# EAGLE design db9splitter (EAGLE 9.0.0)
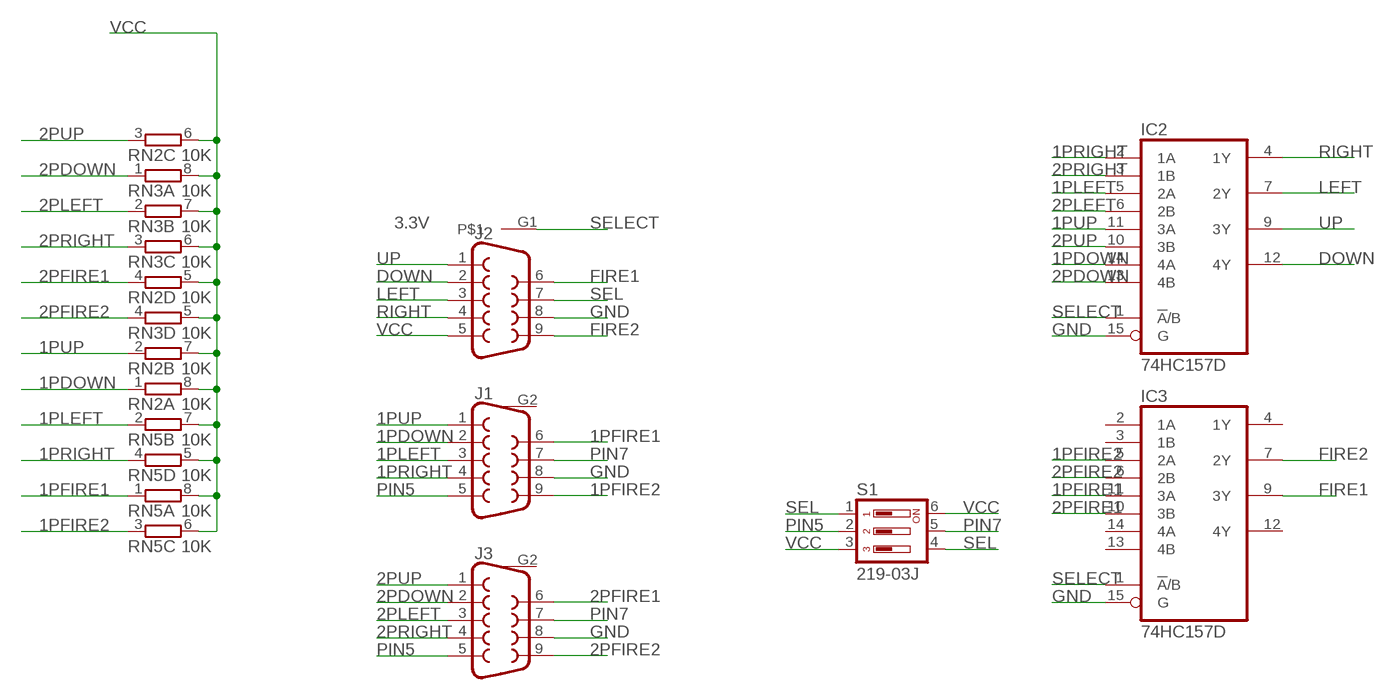
[diagram p0: schematic, sheet 1]

## Parts
IC2  74HC157D  [SO16]
IC3  74HC157D  [SO16]
J1  SPARKFUN-CONNECTORS_DB9MALE  [SPARKFUN-CONNECTORS_DB9_MALE]
J2  DB9FEMALE  [DB9]
J3  SPARKFUN-CONNECTORS_DB9MALE  [SPARKFUN-CONNECTORS_DB9_MALE]
RN2  10K  4R-N0603-ARC  [0603-ARC]
RN3  10K  4R-N0603-ARC  [0603-ARC]
RN5  10K  4R-N0603-ARC  [0603-ARC]
S1  219-03J  [CTS-219-03J]

## Nets
1PDOWN: IC2.14(4A) J1.2 RN2.1
1PFIRE1: IC3.11(3A) J1.6 RN5.1
1PFIRE2: IC3.5(2A) J1.9 RN5.3
1PLEFT: IC2.5(2A) J1.3 RN5.2
1PRIGHT: IC2.2(1A) J1.4 RN5.4
1PUP: IC2.11(3A) J1.1 RN2.2
2PDOWN: IC2.13(4B) J3.2 RN3.1
2PFIRE1: IC3.10(3B) J3.6 RN2.4
2PFIRE2: IC3.6(2B) J3.9 RN3.4
2PLEFT: IC2.6(2B) J3.3 RN3.2
2PRIGHT: IC2.3(1B) J3.4 RN3.3
2PUP: IC2.10(3B) J3.1 RN2.3
DOWN: IC2.12(4Y) J2.2
FIRE1: IC3.9(3Y) J2.6
FIRE2: IC3.7(2Y) J2.9
GND: IC2.15(G) IC3.15(G) J1.8 J2.8 J3.8
LEFT: IC2.7(2Y) J2.3
PIN5: J1.5 J3.5 S1.2
PIN7: J1.7 J3.7 S1.5
RIGHT: IC2.4(1Y) J2.4
SEL: J2.7 S1.1 S1.4
SELECT: IC2.1(!A!/B) IC3.1(!A!/B) J2.G1
UP: IC2.9(3Y) J2.1
VCC: J2.5 RN2.5 RN2.6 RN2.7 RN2.8 RN3.5 RN3.6 RN3.7 RN3.8 RN5.5 RN5.6 RN5.7 RN5.8 S1.3 S1.6
Unconnected: IC3.2(1A) IC3.3(1B) IC3.4(1Y) IC3.12(4Y) IC3.13(4B) IC3.14(4A) J1.G2 J3.G2

## Power pins joined to a net without a drawn wire
GND: IC2.8(GND) IC3.8(GND)
VCC: IC2.16(VCC) IC3.16(VCC)

## Library data of the parts
IC2 IC3 = 74xx-eu:74*157: Quadruple 2-line to 1-line data SELECTOR/MULTIPLEXER
J1 J3 = mister_io2:SPARKFUN-CONNECTORS_DB9: DB9 Connector Standard DB9 (D-Sub 9) serial connector. Can be used for CAN bus as well as RS485 and RS232. Footprint production proven. Here is the female version connector we sell at SparkFun: 9 Pin Female Serial Connector - PCB Mount <https://www.sparkfun.com/products/429> (PRT-00429) This connector has been used on the following SparkFun products: SparkFun RS232 Shifter - SMD <https://www.sparkfun.com/products/449> (PRT-00449) SparkFun RS232 Shifter SMD (No DB9) <https://www.sparkfun.com/products/8780> (PRT-08780); PROD_ID: CONN-09904
J2 = SparkFun-Connectors:DB9: DB9 Connector Standard DB9 (D-Sub 9) serial connector. Can be used for CAN bus as well as RS485 and RS232. Footprint production proven. Here is the female version connector we sell at SparkFun: 9 Pin Female Serial Connector - PCB Mount <https://www.sparkfun.com/products/429> (PRT-00429) This connector has been used on the following SparkFun products: SparkFun RS232 Shifter - SMD <https://www.sparkfun.com/products/449> (PRT-00449) SparkFun RS232 Shifter SMD (No DB9) <https://www.sparkfun.com/products/8780> (PRT-08780); PROD_ID: CONN-08194
RN2 RN3 RN5 = resistor-dil:4R-N: Array Chip Resistor Source: RS Component / Phycomp; OC_FARNELL: unknown; OC_NEWARK: unknown
S1 = switch-dil:219-03*: Surface Mount DIP Switch Series 219 SMT CTS Electronic Components Sourc: www.ctscorp.com; OC_FARNELL: unknown; OC_NEWARK: unknown

## Net classes
1 power: width 0.305 mm, clearance 0.178 mm to class 0, clearance 0.229 mm

## Board
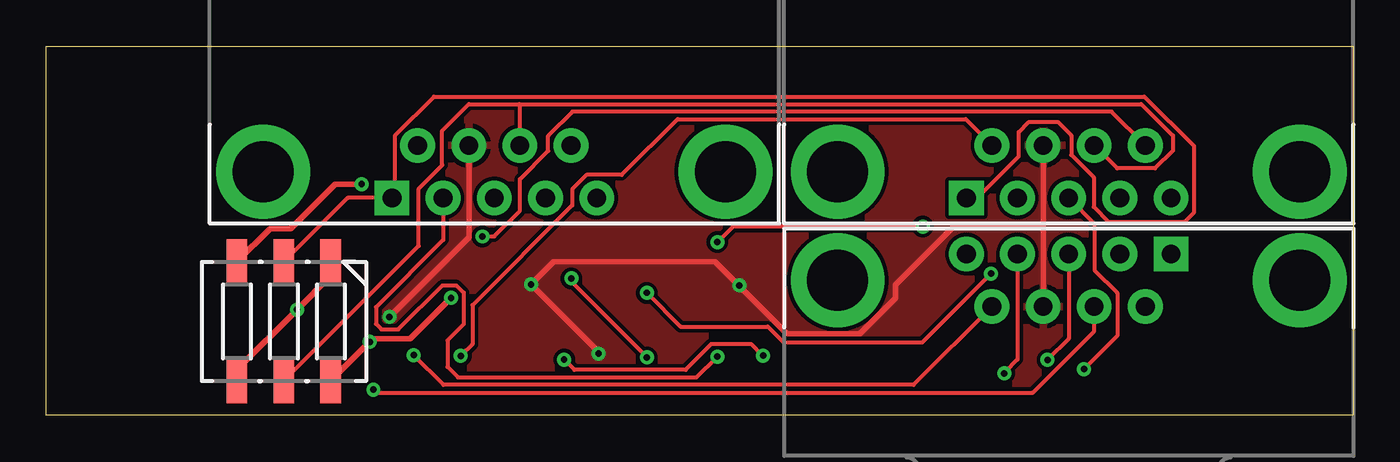
[diagram p1: board, top side]
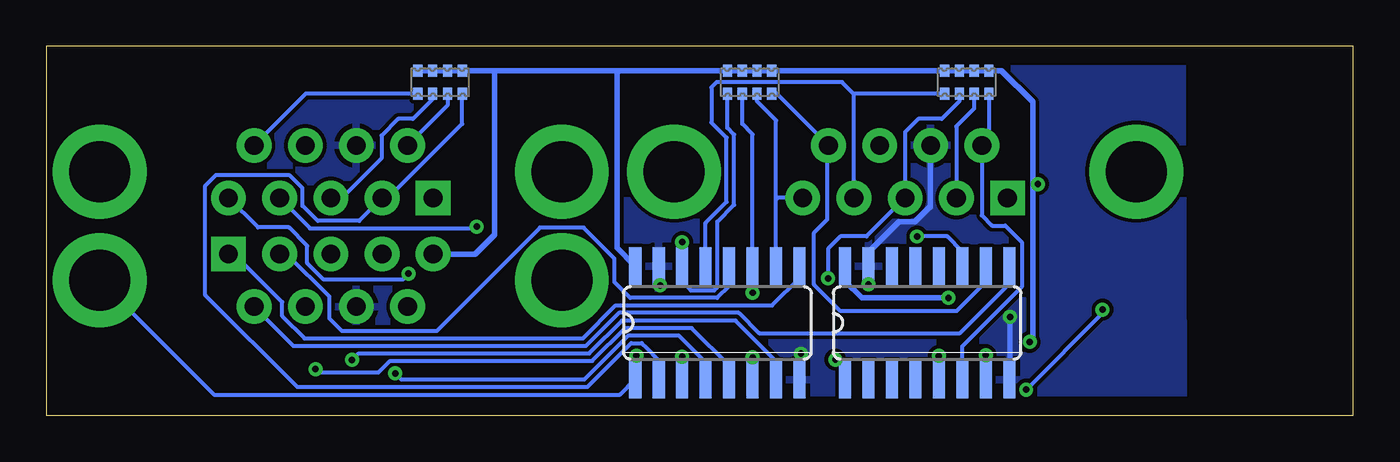
[diagram p2: board, bottom side, seen from below]

Size 70.72 x 19.96 mm. Coordinates in mm from the lower left corner, seen from the top.
Outline: 0,19.96 70.72,19.96 70.72,0 0,0 0,19.96
Copper layers (1*16): Top 0.035mm / dielectric 1.5mm / Bottom 0.035mm
Design rules "default": minimum track width 10mil, minimum drill 24mil, track to track 8mil, track to pad 8mil, pad to pad 8mil, via to via 8mil, smd to smd 8mil, copper to edge 40mil, drill to drill 8mil, minimum pad ring 10mil, minimum via ring 8mil, stop-mask expansion 4mil, vias tented up to drill 0mil, thermal gap 10mil

### Footprints (pad centres in the part's own frame; a part is rotated, then mirrored left to right if it is on the bottom)
SO16 = smd 0.66 x 2.032: 1 -4.445,-3.073; 2 -3.175,-3.073; 3 -1.905,-3.073; 4 -0.635,-3.073; 5 0.635,-3.073; 6 1.905,-3.073; 7 3.175,-3.073; 8 4.445,-3.073; 9 4.445,3.073; 10 3.175,3.073; 11 1.905,3.073; 12 0.635,3.073; 13 -0.635,3.073; 14 -1.905,3.073; 15 -3.175,3.073; 16 -4.445,3.073
SPARKFUN-CONNECTORS_DB9_MALE = drill 1.016 pad 1.88: 1 5.54,-1.42; 2 2.77,-1.42; 3 0,-1.42; 4 -2.77,-1.42; 6 4.15,1.42; 7 1.38,1.42; 8 -1.38,1.42; 9 -4.15,1.42 | drill 1.016 pad 1.88 square: 5 -5.54,-1.42 | drill 3.302 pad 5.08: G1 -12.5,0; G2 12.5,0
DB9 = drill 1.016 pad 1.88 square: 1 -5.54,-1.42 | drill 1.016 pad 1.88: 2 -2.77,-1.42; 3 0,-1.42; 4 2.77,-1.42; 5 5.54,-1.42; 6 -4.15,1.42; 7 -1.38,1.42; 8 1.38,1.42; 9 4.15,1.42 | drill 3.302 pad 5.08: G1 -12.5,0; G2 12.5,0
0603-ARC = smd 0.5 x 0.65: 1 -1.2,-0.625; 2 -0.4,-0.625; 3 0.4,-0.625; 4 1.2,-0.625; 5 1.2,0.625; 6 0.4,0.625; 7 -0.4,0.625; 8 -1.2,0.625
CTS-219-03J = smd 1.13 x 2.44: 1 -2.54,-3.215; 2 0,-3.215; 3 2.54,-3.215; 4 2.54,3.215; 5 0,3.215; 6 -2.54,3.215

### Placement (x,y rotation side)
IC2  34.41,5 0 bottom
IC3  23.06,5 0 bottom
J1  55.32,13.18 0 top
J2  55.32,7.3 180 top
J3  24.25,13.18 0 top
RN2  32.66,18.02 0 bottom
RN3  20.92,18.02 0 bottom
RN5  49.41,18.02 0 bottom
S1  12.86,5.08 180 top

### Tracks (layer width: path | path; a pad name or v marks a point on that pad's centre or on a via)
1PDOWN  (via drill 0.35)
  Top 0.203: v47.43,10.2 37.15,10.2 v36.31,9.37
  Bottom 0.203: RN2.1 33.86,15.55 33.5,15.18 33.5,11.38 34.41,10.47 34.41,6.93 34.59,6.75 35.84,6.75 36.31,7.22 IC2.14 v36.31,9.37 | J1.2 56.44,10.11 47.52,10.11 v47.43,10.2
1PFIRE1  (via drill 0.35)
  Top 0.203: J1.6 57.64,16.43 28.47,16.43 27.15,15.11 27.15,14.3 25.64,12.78 25.64,11.07 24.24,9.67 v23.6,9.67
  Bottom 0.203: IC3.11 21.15,8.85 21.98,9.67 v23.6,9.67 | RN5.1 56.68,17.39 J1.6
1PFIRE2  (via drill 0.35)
  Top 0.203: J1.9 49.75,16.02 34.16,16.02 31.14,13 29.23,13 28.46,12.22 28.46,11.35 23.06,5.95 23.06,3.85 v22.42,3.21
  Bottom 0.203: v22.42,3.21 IC3.5 | RN5.3 49.01,16.76 J1.9
1PLEFT  (via drill 0.35)
  Top 0.203: J1.3 56.71,10.37 56.71,7.86 57.95,6.62 57.95,4.29 v56.16,2.5
  Bottom 0.203: IC2.5 33.77,2.7 35.8,4.72 39.41,4.72 41.18,2.95 52.12,2.95 52.76,2.3 55.96,2.3 v56.16,2.5 | RN5.2 49.81,17.1 50.88,16.03 51.67,16.03 52.59,15.12 52.59,13.89 54.72,11.76 J1.3
1PRIGHT
  Bottom 0.203: J1.4 52.22,11.76 48.21,15.77 RN5.4 | J1.4 | IC2.2 37.58,2.99 38.25,3.66 38.5,3.91 39.07,3.91 41.45,1.52 57.13,1.52 62.11,6.51 62.11,12.42 61.53,13 57.58,13 56.85,12.27 56.85,11.33 56.03,10.51 53.79,10.51 J1.4
1PUP  (via drill 0.35)
  Top 0.203: v32.5,6.63 34.33,4.8 39.04,4.8 39.89,3.95 47.41,3.95 v51.12,7.66
  Bottom 0.203: RN2.2 33.06,15.76 32.5,15.2 IC2.11 v32.5,6.63 | v51.12,7.66 51.44,7.34 55.7,7.34 56.59,8.23 56.59,9.17 57.59,10.16 59.27,10.16 J1.1
2PDOWN
  Bottom 0.203: 35.04,8.93 IC2.13 35.04,10.41 33.9,11.55 33.9,15.01 34.73,15.84 34.73,17.74 34.45,18.02 27.66,18.02 27.04,17.39 | RN3.1 27.04,17.39 | 27.04,17.39 27.02,17.38 J3.2
2PFIRE1
  Bottom 0.203: IC3.10 19.93,8.12 19.93,7.27 19.88,7.22 21.47,5.64 27.74,5.64 29.17,7.06 29.17,9.88 28.46,10.6 28.46,14.54 J3.6 | J3.6 31.2,17.39 RN2.4 | J3.6 28.5,14.5
2PFIRE2
  Bottom 0.203: RN3.4 19.71,14.98 J3.9 20.1,10.81 19.55,10.26 18.83,10.26 17.94,9.37 17.94,6.95 20.91,3.97 21.15,3.73 IC3.6
2PLEFT  (via drill 0.35)
  Top 0.203: v32.5,3.13 28.42,7.22 v28.42,7.41
  Bottom 0.203: RN3.2 21.32,16.98 22.27,16.03 23.54,16.03 24.25,15.32 J3.3 26.33,9.67 27.75,9.67 28.42,9.01 v28.42,7.41 | v32.5,3.13 IC2.6
2PRIGHT  (via drill 0.35)
  Top 0.203: J3.4 21.48,9.49 17.84,5.85 17.84,4.94 18.14,4.64 19.05,4.64 21.44,7.03 22.19,7.03 22.59,6.63 22.59,4.93 21.71,4.05 21.71,2.62 22.28,2.05 35.19,2.05 v36.31,3.17
  Bottom 0.203: RN3.3 20.52,16.59 21.48,15.63 J3.4 | v36.31,3.17 IC2.3
2PUP
  Bottom 0.203: IC2.10 31.23,11.67 | 31.23,11.67 31.23,15.95 32.26,16.98 RN2.3 | J3.1 31.15,11.76 31.23,11.67
DOWN
  Bottom 0.203: 33.77,7.38 IC2.12 33.77,6.99 34.42,6.35 39.13,6.35 39.98,7.2 39.98,8.48 41.65,10.15 44,10.15 49.58,4.57 54.74,4.57 55.41,5.25 55.41,6.43 57.71,8.72 J2.2
FIRE1
  Bottom 0.203: IC3.9 18.61,7.1 21.27,4.45 32.15,4.45 33.24,5.53 39.74,5.53 41.52,3.76 57.35,3.76 J2.6
FIRE2  (via drill 0.35)
  Top 0.203: J2.9 46.93,1.64 21.5,1.64 v19.88,3.25
  Bottom 0.203: IC3.7 v19.88,3.25
GND  (via drill 0.35)
  Top 0.305: J3.8 22.87,9.62 v18.57,5.32 | v29.89,3.33 29.89,3.43 v26.23,7.08 27.44,8.29 36.2,8.29 37.51,6.99 | J1.8 53.94,10.2 | 53.94,10.2 J2.8 | 37.51,6.99 40.08,4.41 44.02,4.41 45.96,6.34 45.96,7.06 49.09,10.2 53.94,10.2 | v37.51,7.03 37.51,6.99
  Bottom 0.305: 22.87,11.26 22.87,11.3 | 22.87,11.3 J3.8 | 22.87,11.3 23.71,10.46 24.58,10.46 26.23,8.81 IC3.15 v26.23,7.08 | IC3.8 18.57,1.97 v18.57,5.32 | v29.89,3.33 29.89,2.01 IC2.8 | 53.94,5.89 J2.8 | IC2.15 37.58,7.11 v37.51,7.03
  pour Bottom: 70.01,0.71 9.21,0.44 9.25,19.33 70.25,19.09
  pour Top: 70.29,0.4 9.17,0.36 9.21,19.41 70.41,19.25
LEFT  (via drill 0.35)
  Top 0.203: v54.17,2.99 55.32,4.14 J2.3
  Bottom 0.203: 31.23,2.83 IC2.7 31.23,2.94 33.42,5.13 39.57,5.13 41.35,3.35 53.81,3.35 v54.17,2.99
PIN5
  Top 0.203: S1.2 16.32,11.76 J3.5 18.85,11.9 18.85,15.11 20.98,17.24 59.41,17.24 62.11,14.55 62.11,10.99 61.59,10.48 57.47,10.48 56.67,11.27 56.67,12.87 55.46,14.08 55.46,15.14 54.73,15.88 53.18,15.88 52.63,15.32 52.63,14.01 50.37,11.76 J1.5
PIN7
  Top 0.203: S1.5 20.16,9.17 20.16,12.26 21.43,13.53 21.43,15.4 22.87,16.83 25.6,16.83 | J1.7 57.95,13.35 59.99,13.35 60.96,14.32 60.96,15.12 59.25,16.83 25.6,16.83 | J3.7 25.63,16.8 25.6,16.83
RIGHT  (via drill 0.35)
  Top 0.203: J2.4 52.55,3.02 51.83,2.3 v51.83,2.26
  Bottom 0.203: IC2.4 35.04,2.87 36.49,4.32 37.03,4.32 37.86,4.32 39.24,4.32 41.62,1.93 51.5,1.93 v51.83,2.26
SEL  (via drill 0.35)
  Top 0.203: v17.7,1.39 17.86,1.23 53.38,1.23 56.7,4.55 J2.7
  Top 0.305: S1.1 15.4,7.54 v13.57,5.71 10.32,2.46 S1.4
  Bottom 0.203: v17.7,1.39 13.57,5.52 v13.57,5.71
SELECT  (via drill 0.35)
  Top 0.203: v28.02,3.02 28.58,2.45 34.6,2.45 36.01,3.86 38.13,3.86 38.76,3.23 v38.78,3.23
  Bottom 0.203: 27.5,2.37 IC3.1 27.5,2.5 v28.02,3.02 | IC2.1 38.85,1.95 | J2.G1 61.64,1.12 39.68,1.12 38.85,1.95 | v38.78,3.23 38.78,2.01 38.85,1.95
UP
  Bottom 0.203: IC2.9 29.96,7.42 | 29.96,7.42 29.96,7.38 | 29.96,7.42 31.45,5.94 39.91,5.94 41.69,4.17 56.75,4.17 57.95,5.37 57.95,6.12 60.55,8.72 J2.1
VCC  (via drill 0.35)
  Top 0.305: S1.3 12.1,10.08 13.22,10.08 15.64,12.5 v17.07,12.5 | 21.94,6.35 v21.91,6.35 19.68,4.13 17.66,4.13 v17.5,3.97 S1.6
  Bottom 0.305: v21.91,6.35 26.59,6.35 27.5,7.26 IC3.16 | IC2.16 39.85,9.07 39.85,18.52 39.73,18.64 | 39.73,18.64 RN2.8 RN2.7 RN2.6 RN2.5 RN3.8 RN3.7 RN3.6 RN3.5 19.04,18.64 17.34,16.95 17.34,12.42 | 39.73,18.64 46.4,18.64 | 46.4,18.64 RN5.5 RN5.6 RN5.7 RN5.8 | J2.5 47.52,8.72 46.47,9.76 46.47,18.56 46.4,18.64 | v17.5,3.97 17.34,4.13 17.34,12.42 | v17.07,12.5 17.14,12.42 17.34,12.42